# Altium project WT-312.PrjPcb
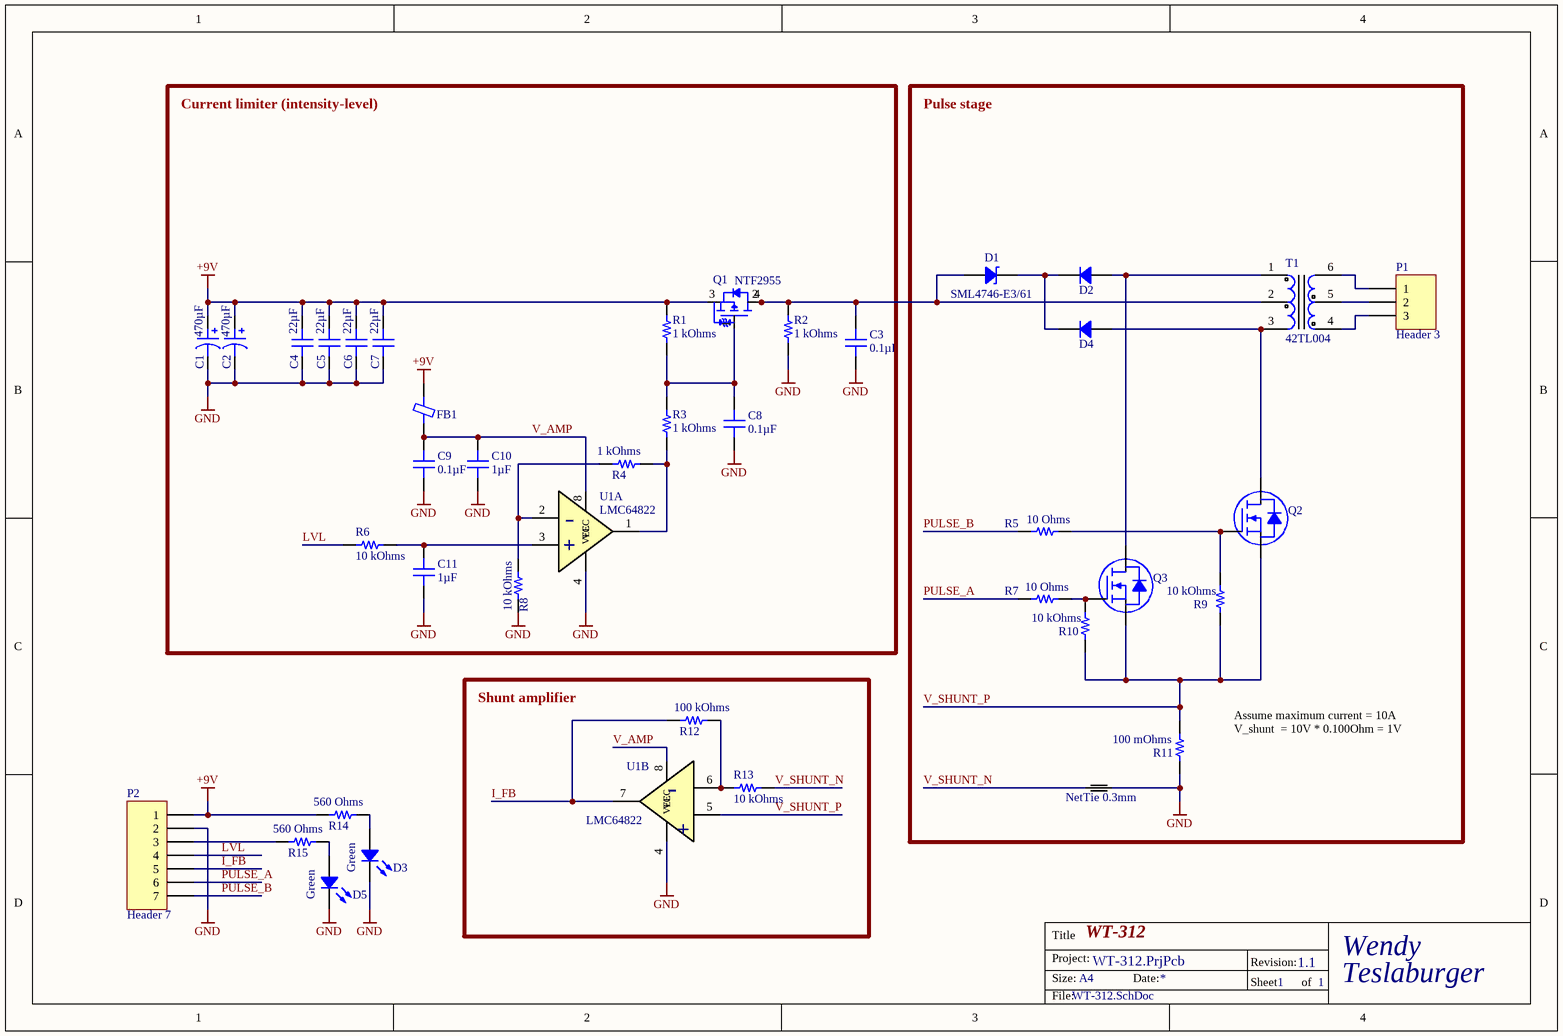
[diagram p0: WT-312.SchDoc]
1 sheet, 40 parts. Net scope: global (net labels, ports and power ports of the same name join across sheets).
Board file: WT-312.pcbdoc

## Sheet WT-312.SchDoc: WT-312
size A4; DocumentNumber: 1; Revision: 1.1; SheetNumber: 1; SheetTotal: 1

### Parts
C1  470µF  [CAP TH ALUM ELEC D8.00mm S3.50mm H13.00mm]
C2  470µF  [CAP TH ALUM ELEC D8.00mm S3.50mm H13.00mm]
C3  0.1µF  [CAP 0603_1608]
C4  22µF  [CAP 1210_3225 - 2.8MM]
C5  22µF  [CAP 1210_3225 - 2.8MM]
C6  22µF  [CAP 1210_3225 - 2.8MM]
C7  22µF  [CAP 1210_3225 - 2.8MM]
C8  0.1µF  [CAP 0603_1608]
C9  0.1µF  [CAP 0603_1608]
C10  1µF  [CAP 0603_1608]
C11  1µF  [CAP 0603_1608]
D1  SML4746-E3/61  [DO214AC SMA]
D2  DSS14UTR  [SOD123F]  (value not drawn)
D3  Green  [LED 1206_3216 GREEN]
D4  DSS14UTR  [SOD123F]  (value not drawn)
D5  Green  [LED 1206_3216 GREEN]
FB1  100 Ohms @ 100MHz  [FER 0603_1608]  (value not drawn)
NT  NetTie 0.3mm  [NetTie0.3mm]
P1  Header 3  [HDR1X3]
P2  Header 7  [HDR1X7]
Q1  NTF2955  [SOT230P700X175-4N]
Q2  DMN2041L-7  [DIODES SOT-23-3]  (value not drawn)
Q3  DMN2041L-7  [DIODES SOT-23-3]  (value not drawn)
R1  1 kOhms  [RES 0603_1608]
R2  1 kOhms  [RES 0603_1608]
R3  1 kOhms  [RES 0603_1608]
R4  1 kOhms  [RES 0603_1608]
R5  10 Ohms  [RES 0603_1608]
R6  10 kOhms  [RES 0603_1608]
R7  10 Ohms  [RES 0603_1608]
R8  10 kOhms  [RES 0603_1608]
R9  10 kOhms  [RES 0603_1608]
R10  10 kOhms  [RES 0603_1608]
R11  100 mOhms  [RES 1206_3216]
R12  100 kOhms  [RES 0603_1608]
R13  10 kOhms  [RES 0603_1608]
R14  560 Ohms  [RES 0603_1608]
R15  560 Ohms  [RES 0603_1608]
T1  42TL004  [42TL-Series]
U1  LMC64822  [SOIC127P490X175-8N]  (parts A,B of 2)

### Blocks framed on the sheet
Current limiter (intensity-level): C1-C11 FB1 Q1 R1-R4 R6 R8 U1
Pulse stage: D1 D2 D4 NT P1 Q2 Q3 R5 R7 R9-R11 T1
Shunt amplifier: R12 R13 U1

### Nets
+9V: C1.1 C2.1 C4.2 C5.2 C6.2 C7.2 FB1.1 P2.1 Q1.3(S) R1.1 R14.2
GND: C1.2 C2.2 C3.1 C4.1 C5.1 C6.1 C7.1 C8.1 C9.1 C10.1 C11.1 D3.2 D5.2 NT.2 P2.2 R2.2 R8.1 R11.1 U1.4(VEE)
I_FB: P2.5 R12.1 U1.7(VOUT)
LVL: P2.4 R6.2
PULSE_A: P2.6 R7.1
PULSE_B: P2.7 R5.1
V_AMP: C9.2 C10.2 FB1.2 U1.8(VCC)
V_SHUNT_N: NT.1 R13.1
V_SHUNT_P: Q2.2(S) Q3.2(S) R9.1 R10.1 R11.2 U1.5(INP)
NetC3_2: C3.2 D1.1 Q1.2(D) Q1.4(D) R2.1 T1.2(Pri_C)
NetC8_2: C8.2 Q1.1(G) R1.2 R3.1
NetC11_2: C11.2 R6.1 U1.3(INP)
NetD1_2: D1.2 D2.2 D4.2
NetD2_1: D2.1 Q3.3(D) T1.1(Pri_H)
NetD3_1: D3.1 R14.1
NetD4_1: D4.1 Q2.3(D) T1.3(Pri_L)
NetD5_1: D5.1 R15.1
NetP1_1: P1.1 T1.6(Sec_H)
NetP1_2: P1.2 T1.5(Sec_C)
NetP1_3: P1.3 T1.4(Sec_L)
NetP2_3: P2.3 R15.2
NetQ2_1: Q2.1(G) R5.2 R9.2
NetQ3_1: Q3.1(G) R7.2 R10.2
NetR3_2: R3.2 R4.1 U1.1(VOUT)
NetR4_2: R4.2 R8.2 U1.2(INN)
NetR12_2: R12.2 R13.2 U1.6(INN)

### Notes on the sheet
- Assume maximum current = 10A
  V_shunt  = 10V * 0.100Ohm = 1V
- Title
- Size:
- Project:
- A4
- Date:
- Revision:
- Sheet
- of
- Wendy
- Teslaburger
- File:
- (in symbol LMC64822, part A) -; +
- (in symbol LMC64822, part B) -; +

### Library data of the parts
C1 C2 = 477CKE016M: CAP ALUM 470UF 20% 16V RADIAL; Manufacturer: Illinois Capacitor; ESR (Equivalent Series Resistance): 564.4mOhm @ 120Hz; Lifetime @ Temp.: 2000 Hrs @ 105°C; Polarization: Polar; Ripple Current @ Low Frequency: 365mA @ 120Hz; Part Number: 477CKE016M; Applications: General Purpose; Capacitance: 470µF; ComponentLink1Description: Datasheet; ComponentLink1URL: http://www.illinoiscapacitor.com/pdf/seriesDocuments/CKH_CKE%20series.pdf; ComponentLink2Description: DigiKey Link; ComponentLink2URL: http://digikey.com/product-detail/en/illinois-capacitor/477CKE016M/1572-1744-ND/5412869; Device Package: Radial, Can; Height - Seated (Max): 0.512" (13.00mm); LastUpdated: 07/09/2020 05:24:52; Lead Spacing: 0.138" (3.50mm); Lifecycle Status: Active; Minimum Order: 1; Mounting Type: Through Hole; Operating Temperature: -40°C ~ 105°C; Package / Case: Radial, Can; Packaging: Bulk; PartId: 23777; Part Status: Active; Price: 0.32; Series: CKE; Size / Dimension: 0.315" Dia (8.00mm); Supplier 1: DigiKey; Supplier Part Number 1: 1572-1744-ND; Tolerance: ±20%; Value: 470µF; Voltage - Rated: 16V
C3 C8 C9 = C0603C104K5RAC7411: CAP CER 0.1UF 50V X7R 0603; Manufacturer: KEMET; Tolerance: ±10%; Part Number: C0603C104K5RAC7411; Applications: Bypass, Decoupling; Capacitance: 0.1µF; ComponentLink1Description: Datasheet; ComponentLink1URL: https://api.kemet.com/component-edge/download/datasheet/C0603C104K5RAC7411.pdf; ComponentLink2Description: DigiKey Link; ComponentLink2URL: http://digikey.com/product-detail/en/kemet/C0603C104K5RAC7411/399-7374-2-ND/3317013; Device Package: 0603 (1608 Metric); LastUpdated: 02/09/2020 01:03:36; Lifecycle Status: Active; Minimum Order: 15000; Mounting Type: Surface Mount, MLCC; Operating Temperature: -55°C ~ 125°C; Package / Case: 0603 (1608 Metric); Packaging: TapeAndReel; PartId: 2233; Part Status: Active; Price: 0.02; Series: SMD Comm X7R; Size / Dimension: 0.063" L x 0.031" W (1.60mm x 0.80mm); Supplier 1: DigiKey; Supplier Part Number 1: 399-7374-2-ND; Temperature Coefficient: X7R; Thickness (Max): 0.035" (0.90mm); Value: 0.1µF; Voltage - Rated: 50V
C4-C7 = TMK325BJ226MM-T: CAP CER 22UF 25V X5R 1210; Manufacturer: Taiyo Yuden; Tolerance: ±20%; Part Number: TMK325BJ226MM-T; Applications: General Purpose; Capacitance: 22µF; ComponentLink1Description: Datasheet; ComponentLink1URL: https://www.yuden.co.jp/productdata/catalog/mlcc01_e.pdf; ComponentLink2Description: DigiKey Link; ComponentLink2URL: http://digikey.com/product-detail/en/taiyo-yuden/TMK325BJ226MM-T/587-2086-1-ND/1789033; Device Package: 1210 (3225 Metric); LastUpdated: 02/09/2020 01:10:51; Lifecycle Status: Active; Minimum Order: 1; Mounting Type: Surface Mount, MLCC; Operating Temperature: -55°C ~ 85°C; Package / Case: 1210 (3225 Metric); Packaging: TapeAndReel; PartId: 23820; Part Status: Active; Price: 0.29; Series: M; Size / Dimension: 0.126" L x 0.098" W (3.20mm x 2.50mm); Supplier 1: DigiKey; Supplier Part Number 1: 587-2086-1-ND; Temperature Coefficient: X5R; Thickness (Max): 0.106" (2.70mm); Value: 22µF; Voltage - Rated: 25V
C10 C11 = TMJ107CB7105KAHR: CAP CER 1UF 25V X7R 0603; Manufacturer: Taiyo Yuden; Tolerance: ±10%; Part Number: TMJ107CB7105KAHR; Applications: Automotive, Boardflex Sensitive; Capacitance: 1µF; ComponentLink1Description: Datasheet; ComponentLink1URL: https://www.yuden.co.jp/productdata/catalog//mlcc11_hq_e.pdf; ComponentLink2Description: DigiKey Link; ComponentLink2URL: http://digikey.com/product-detail/en/taiyo-yuden/TMJ107CB7105KAHR/587-4353-1-ND/5405550; Device Package: 0603 (1608 Metric); Features: Soft Termination; LastUpdated: 02/09/2020 01:03:31; Lifecycle Status: Active; Minimum Order: 1; Mounting Type: Surface Mount, MLCC; Operating Temperature: -55°C ~ 125°C; Package / Case: 0603 (1608 Metric); Packaging: TapeAndReel; PartId: 4682; Part Status: Active; Price: 0.04; Ratings: AEC-Q200; Series: M; Size / Dimension: 0.063" L x 0.031" W (1.60mm x 0.80mm); Supplier 1: DigiKey; Supplier Part Number 1: 587-4353-1-ND; Temperature Coefficient: X7R; Thickness (Max): 0.035" (0.90mm); Value: 1µF; Voltage - Rated: 25V
D1 = SML4746-E3/61: DIODE ZENER 18V 1W DO214AC; Manufacturer: Vishay Semiconductor Diodes Division; Current - Reverse Leakage @ Vr: 5µA @ 13.7V; Impedance (Max) (Zzt): 20 Ohms; Tolerance: ±10%; Part Number: SML4746-E3/61; ComponentLink1Description: Datasheet; ComponentLink1URL: //media.digikey.com/pdf/Data%20Sheets/Vishay%20Siliconix%20PDFs/SML4728-SML4764A.pdf; ComponentLink2Description: DigiKey Link; ComponentLink2URL: http://digikey.com/product-detail/en/vishay-semiconductor-diodes-division/SML4746-E3-61/SML4746-E3-61GICT-ND/8565238; LastUpdated: 02/09/2020 01:19:18; Lifecycle Status: Active; Minimum Order: 1; Mounting Type: Surface Mount; Operating Temperature: 150°C; Package / Case: DO-214AC, SMA; Packaging: TapeAndReel; PartId: 1538; Part Status: Active; Power - Max: 1W; Price: 0.17; Series: Automotive, AEC-Q101; Supplier 1: DigiKey; Supplier Part Number 1: SML4746-E3/61GICT-ND; Supplier Device Package: DO-214AC (SMA); Voltage - Zener (Nom) (Vz): 18V
D2 D4 = DSS14UTR: SCHOTTKY 40V SOD-123FL; Manufacturer: SMC Diode Solutions; Capacitance @ Vr, F: 110pF @ 4V, 1MHz; Current - Average Rectified (Io): 1A; Current - Reverse Leakage @ Vr: 100µA @ 40V; Speed: Fast Recovery =< 500ns, > 200mA (Io); Voltage - Forward (Vf) (Max) @ If: 500mV @ 1A; Part Number: DSS14UTR; ComponentLink1Description: Datasheet; ComponentLink1URL: http://www.smc-diodes.com/propdf/DSS12U%20THRU%20DSS125U%20N1873%20REV.A.pdf; ComponentLink2Description: DigiKey Link; ComponentLink2URL: http://digikey.com/product-detail/en/smc-diode-solutions/DSS14UTR/1655-1927-1-ND/8341869; Diode Type: Schottky; LastUpdated: 02/09/2020 01:19:10; Lifecycle Status: Active; Minimum Order: 1; Mounting Type: Surface Mount; Operating Temperature - Junction: -55°C ~ 150°C; Package / Case: SOD-123F; Packaging: TapeAndReel; PartId: 2515; Part Status: Active; Price: 0.03; Series: -; Supplier 1: DigiKey; Supplier Part Number 1: 1655-1927-1-ND; Supplier Device Package: SOD-123FL; Voltage - DC Reverse (Vr) (Max): 40V
D3 D5 = APTD3216LCGCK: LED GREEN CLEAR 2SMD; Manufacturer: Kingbright; Configuration: Standard; Current - Test: 2mA; Lens Color: Colorless; Lens Size: 1.60mm Dia; Lens Style: Round with Domed Top; Millicandela Rating: 25mcd; Viewing Angle: 40°; Voltage - Forward (Vf) (Typ): 1.9V; Wavelength - Dominant: 570nm; Wavelength - Peak: 574nm; Part Number: APTD3216LCGCK; Color: Green; ComponentLink1Description: Datasheet; ComponentLink1URL: http://www.kingbrightusa.com/images/catalog/SPEC/APTD3216LCGCK.pdf; ComponentLink2Description: DigiKey Link; ComponentLink2URL: http://digikey.com/product-detail/en/kingbright/APTD3216LCGCK/754-2049-1-ND/7043101; Device Package: 1206 (3216 Metric); Height (Max): 1.90mm; LastUpdated: 02/09/2020 01:20:47; Lens Transparency: Clear; Lifecycle Status: Active; Minimum Order: 1; Mounting Type: Surface Mount; Package / Case: 1206 (3216 Metric); Packaging: TapeAndReel; PartId: 541; Part Status: Active; Price: 0.10; Series: -; Size / Dimension: 3.20mm L x 1.60mm W; Supplier 1: DigiKey; Supplier Part Number 1: 754-2049-1-ND; Supplier Device Package: 2-SMD; Value: Green
FB1 = BLM18KG101TN1D: FERRITE BEAD 100 OHM 0603 1LN; Manufacturer: Murata Electronics; Current Rating (Max): 3A; DC Resistance (DCR) (Max): 30mOhm; Filter Type: Power Line; Number of Lines: 1; Part Number: BLM18KG101TN1D; ComponentLink1Description: Datasheet; ComponentLink1URL: //media.digikey.com/pdf/Data%20Sheets/Murata%20PDFs/BLM18yyyyyyN1x.pdf; ComponentLink2Description: DigiKey Link; ComponentLink2URL: http://digikey.com/product-detail/en/murata-electronics/BLM18KG101TN1D/490-5448-1-ND/2260755; Device Package: 0603 (1608 Metric); Height (Max): 0.030" (0.75mm); Impedance @ Frequency: 100 Ohms @ 100MHz; LastUpdated: 02/09/2020 01:18:17; Lifecycle Status: Active; Minimum Order: 1; Mounting Type: Surface Mount; Operating Temperature: -55°C ~ 125°C; Package / Case: 0603 (1608 Metric); Packaging: TapeAndReel; PartId: 1071; Part Status: Active; Price: 0.02; Series: EMIFIL®, BLM18; Size / Dimension: 0.063" L x 0.032" W (1.60mm x 0.80mm); Supplier 1: DigiKey; Supplier Part Number 1: 490-5448-1-ND; Value: 100 Ohms @ 100MHz
NT = NetTie_0.3mm
P1 = Header 3: Header, 3-Pin; LatestRevisionDate: 17-Jul-2002; LatestRevisionNote: Re-released for DXP Platform.; Publisher: Altium Limited
P2 = Header 7: Header, 7-Pin; LatestRevisionDate: 17-Jul-2002; LatestRevisionNote: Re-released for DXP Platform.; Publisher: Altium Limited
Q1 = NTF2955: Single, P-Channel, SOT-223 -60 V, -2.6 A; Supplier 1: Mouser; Supplier Part Number 1: 863-NTF2955T1G; Price: 0.855
Q2 Q3 = DMN2041L-7: MOSFET N-CH 20V 6.4A SOT23; Manufacturer: Diodes Incorporated; Current - Continuous Drain (Id) @ 25°C: 6.4A (Ta); Drive Voltage (Max Rds On,  Min Rds On): 2.5V, 4.5V; FET Type: N-Channel; Gate Charge (Qg) (Max) @ Vgs: 15.6nC @ 10V; Input Capacitance (Ciss) (Max) @ Vds: 550pF @ 10V; Power Dissipation (Max): 780mW (Ta); Rds On (Max) @ Id, Vgs: 28mOhm @ 6A, 4.5V; Vgs (Max): ±12V; Vgs(th) (Max) @ Id: 1.2V @ 250µA; Part Number: DMN2041L-7; ComponentLink1Description: Datasheet; ComponentLink1URL: https://www.diodes.com/assets/Datasheets/products_inactive_data/DMN2041L.pdf; ComponentLink2Description: DigiKey Link; ComponentLink2URL: http://digikey.com/product-detail/en/diodes-incorporated/DMN2041L-7/DMN2041L-7DICT-ND/2182586; Drain to Source Voltage (Vdss): 20V; LastUpdated: 02/09/2020 01:25:02; Lifecycle Status: Active; Minimum Order: 1; Mounting Type: Surface Mount; Operating Temperature: -55°C ~ 150°C (TJ); Package / Case: TO-236-3, SC-59, SOT-23-3; Packaging: TapeAndReel; Part Status: Active; Price: 0.08; Series: -; Supplier 1: DigiKey; Supplier Part Number 1: DMN2041L-7DICT-ND; Supplier Device Package: SOT-23-3; Technology: MOSFET (Metal Oxide)
R1-R4 = CRCW06031K00FKTA: RES SMD 1K OHM 1% 1/10W 0603; Manufacturer: Vishay Dale; Power (Watts): 0.1W, 1/10W; Temperature Coefficient: ±100ppm/°C; Part Number: CRCW06031K00FKTA; ComponentLink1Description: Datasheet; ComponentLink1URL: http://www.vishay.com/docs/20008/dcrcw.pdf; ComponentLink2Description: DigiKey Link; ComponentLink2URL: http://digikey.com/product-detail/en/vishay-dale/CRCW06031K00FKTA/541-2987-1-ND/6073630; Composition: Thick Film; Device Package: 0603 (1608 Metric); Features: Automotive AEC-Q200; Height - Seated (Max): 0.020" (0.50mm); LastUpdated: 02/09/2020 01:09:58; Lifecycle Status: Active; Minimum Order: 1; Number of Terminations: 2; Operating Temperature: -55°C ~ 155°C; Package / Case: 0603 (1608 Metric); Packaging: TapeAndReel; PartId: 17528; Part Status: Active; Price: 0.01; Ratings: AEC-Q200; Resistance: 1 kOhms; Series: CRCW; Size / Dimension: 0.063" L x 0.033" W (1.60mm x 0.85mm); Supplier 1: DigiKey; Supplier Part Number 1: 541-2987-1-ND; Supplier Device Package: 0603; Tolerance: ±1%; Value: 1 kOhms
R5 R7 = AC0603FR-0710RL: RES SMD 10 OHM 1% 1/10W 0603; Manufacturer: Yageo; Power (Watts): 0.1W, 1/10W; Temperature Coefficient: ±200ppm/°C; Part Number: AC0603FR-0710RL; ComponentLink1Description: Datasheet; ComponentLink1URL: https://www.yageo.com/upload/media/product/productsearch/datasheet/rchip/PYu-AC_51_RoHS_L_7.pdf; ComponentLink2Description: DigiKey Link; ComponentLink2URL: http://digikey.com/product-detail/en/yageo/AC0603FR-0710RL/311-10LDCT-ND/2828514; Composition: Thick Film; Device Package: 0603 (1608 Metric); Features: Automotive AEC-Q200, Moisture Resistant; Height - Seated (Max): 0.022" (0.55mm); LastUpdated: 02/09/2020 01:10:18; Lifecycle Status: Active; Minimum Order: 1; Number of Terminations: 2; Operating Temperature: -55°C ~ 155°C; Package / Case: 0603 (1608 Metric); Packaging: TapeAndReel; PartId: 8121; Part Status: Active; Price: 0.01; Ratings: AEC-Q200; Resistance: 10 Ohms; Series: AC; Size / Dimension: 0.063" L x 0.031" W (1.60mm x 0.80mm); Supplier 1: DigiKey; Supplier Part Number 1: 311-10LDCT-ND; Supplier Device Package: 0603; Tolerance: ±1%; Value: 10 Ohms
R6 R8-R10 R13 = RN73H1JTTD1002F100: RES 10K OHM 1% 1/10W 0603; Manufacturer: KOA Speer Electronics, Inc.; Power (Watts): 0.1W, 1/10W; Temperature Coefficient: ±100ppm/°C; Part Number: RN73H1JTTD1002F100; ComponentLink2Description: DigiKey Link; ComponentLink2URL: http://digikey.com/product-detail/en/koa-speer-electronics-inc/RN73H1JTTD1002F100/2019-RN73H1JTTD1002F100CT-ND/10707129; Composition: Metal Film; Device Package: 0603 (1608 Metric); Features: Automotive AEC-Q200, Moisture Resistant; Height - Seated (Max): 0.022" (0.55mm); LastUpdated: 02/09/2020 01:09:24; Lifecycle Status: Active; Minimum Order: 1; Number of Terminations: 2; Operating Temperature: -55°C ~ 155°C; Package / Case: 0603 (1608 Metric); Packaging: TapeAndReel; PartId: 26823; Part Status: Active; Price: 0.06; Ratings: AEC-Q200; Resistance: 10 kOhms; Series: RN73H; Size / Dimension: 0.063" L x 0.031" W (1.60mm x 0.80mm); Supplier 1: DigiKey; Supplier Part Number 1: 2019-RN73H1JTTD1002F100CT-ND; Supplier Device Package: 0603; Tolerance: ±1%; Value: 10 kOhms
R11 = SCRR1206S1-R100F: RES 0.1 OHM 1% 1W 1206; Manufacturer: Delta Electronics/Cyntec; Temperature Coefficient: ±100ppm/°C; Part Number: SCRR1206S1-R100F; ComponentLink2Description: DigiKey Link; ComponentLink2URL: http://digikey.com/product-detail/en/delta-electronics-cyntec/SCRR1206S1-R100F/2037-SCRR1206S1-R100FCT-ND/10446103; Composition: Thick Film; Device Package: 1206 (3216 Metric); Features: Current Sense; Height - Seated (Max): 0.033" (0.85mm); LastUpdated: 02/09/2020 01:13:07; Lifecycle Status: Active; Minimum Order: 1; Number of Terminations: 2; Operating Temperature: -55°C ~ 155°C; Package / Case: 1206 (3216 Metric); Packaging: TapeAndReel; PartId: 27736; Part Status: Active; Power (Watts): 1W; Price: 0.14; Resistance: 100 mOhms; Series: SCRR; Size / Dimension: 0.126" L x 0.063" W (3.20mm x 1.60mm); Supplier 1: DigiKey; Supplier Part Number 1: 2037-SCRR1206S1-R100FCT-ND; Supplier Device Package: 1206; Tolerance: ±1%; Value: 100 mOhms
R12 = CRCW0603100KFKEA: RES SMD 100K OHM 1% 1/10W 0603; Manufacturer: Vishay Dale; Power (Watts): 0.1W, 1/10W; Temperature Coefficient: ±100ppm/°C; Part Number: CRCW0603100KFKEA; ComponentLink1Description: Datasheet; ComponentLink1URL: http://www.vishay.com/docs/20035/dcrcwe3.pdf; ComponentLink2Description: DigiKey Link; ComponentLink2URL: http://digikey.com/product-detail/en/vishay-dale/CRCW0603100KFKEA/541-100KHCT-ND/1180038; Composition: Thick Film; Device Package: 0603 (1608 Metric); Features: Automotive AEC-Q200; Height - Seated (Max): 0.020" (0.50mm); LastUpdated: 02/09/2020 01:09:36; Lifecycle Status: Active; Minimum Order: 1; Number of Terminations: 2; Operating Temperature: -55°C ~ 155°C; Package / Case: 0603 (1608 Metric); Packaging: CutTape; PartId: 24639; Part Status: Active; Price: 0.10; Ratings: AEC-Q200; Resistance: 100 kOhms; Series: CRCW; Size / Dimension: 0.061" L x 0.033" W (1.55mm x 0.85mm); Supplier 1: DigiKey; Supplier Part Number 1: 541-100KHCT-ND; Supplier Device Package: 0603; Tolerance: ±1%; Value: 100 kOhms
R14 R15 = CR0603-FX-5600ELF: RES SMD 560 OHM 1% 1/10W 0603; Manufacturer: Bourns Inc.; Power (Watts): 0.1W, 1/10W; Temperature Coefficient: ±100ppm/°C; Part Number: CR0603-FX-5600ELF; ComponentLink1Description: Datasheet; ComponentLink1URL: https://www.bourns.com/docs/Product-Datasheets/CHPREZTR.pdf; ComponentLink2Description: DigiKey Link; ComponentLink2URL: http://digikey.com/product-detail/en/bourns-inc/CR0603-FX-5600ELF/CR0603-FX-5600ELFCT-ND/3925324; Composition: Thick Film; Device Package: 0603 (1608 Metric); Features: Moisture Resistant; Height - Seated (Max): 0.022" (0.55mm); LastUpdated: 02/09/2020 01:09:54; Lifecycle Status: Active; Minimum Order: 1; Number of Terminations: 2; Operating Temperature: -55°C ~ 155°C; Package / Case: 0603 (1608 Metric); Packaging: CutTape; PartId: 19135; Part Status: Active; Price: 0.10; Resistance: 560 Ohms; Series: CR0603; Size / Dimension: 0.063" L x 0.031" W (1.60mm x 0.80mm); Supplier 1: DigiKey; Supplier Part Number 1: CR0603-FX-5600ELFCT-ND; Supplier Device Package: 0603; Tolerance: ±1%; Value: 560 Ohms
T1 = 42LT004: Miniature audio transformer; ComponentLink1Description: Supplier; ComponentLink1URL: https://www.mouser.be/ProductDetail/Xicon/42TL004-RC?qs=%252BLh6ltJumVRX87vpOY3zCA%3D%3D; ComponentLink2Description: Datasheet; ComponentLink2URL: https://www.mouser.be/datasheet/2/449/Yuetone_XC-600127-1212403.pdf
U1 = LMC64822: CMOS Dual Rail-to-Rail Input and Output Operational Amplifier; Supplier 1: Mouser; Supplier Part Number 1: 511-LMC6482IDT; Price: 0.847

## Assembly variants
Normal: not fitted R3 R4 R16